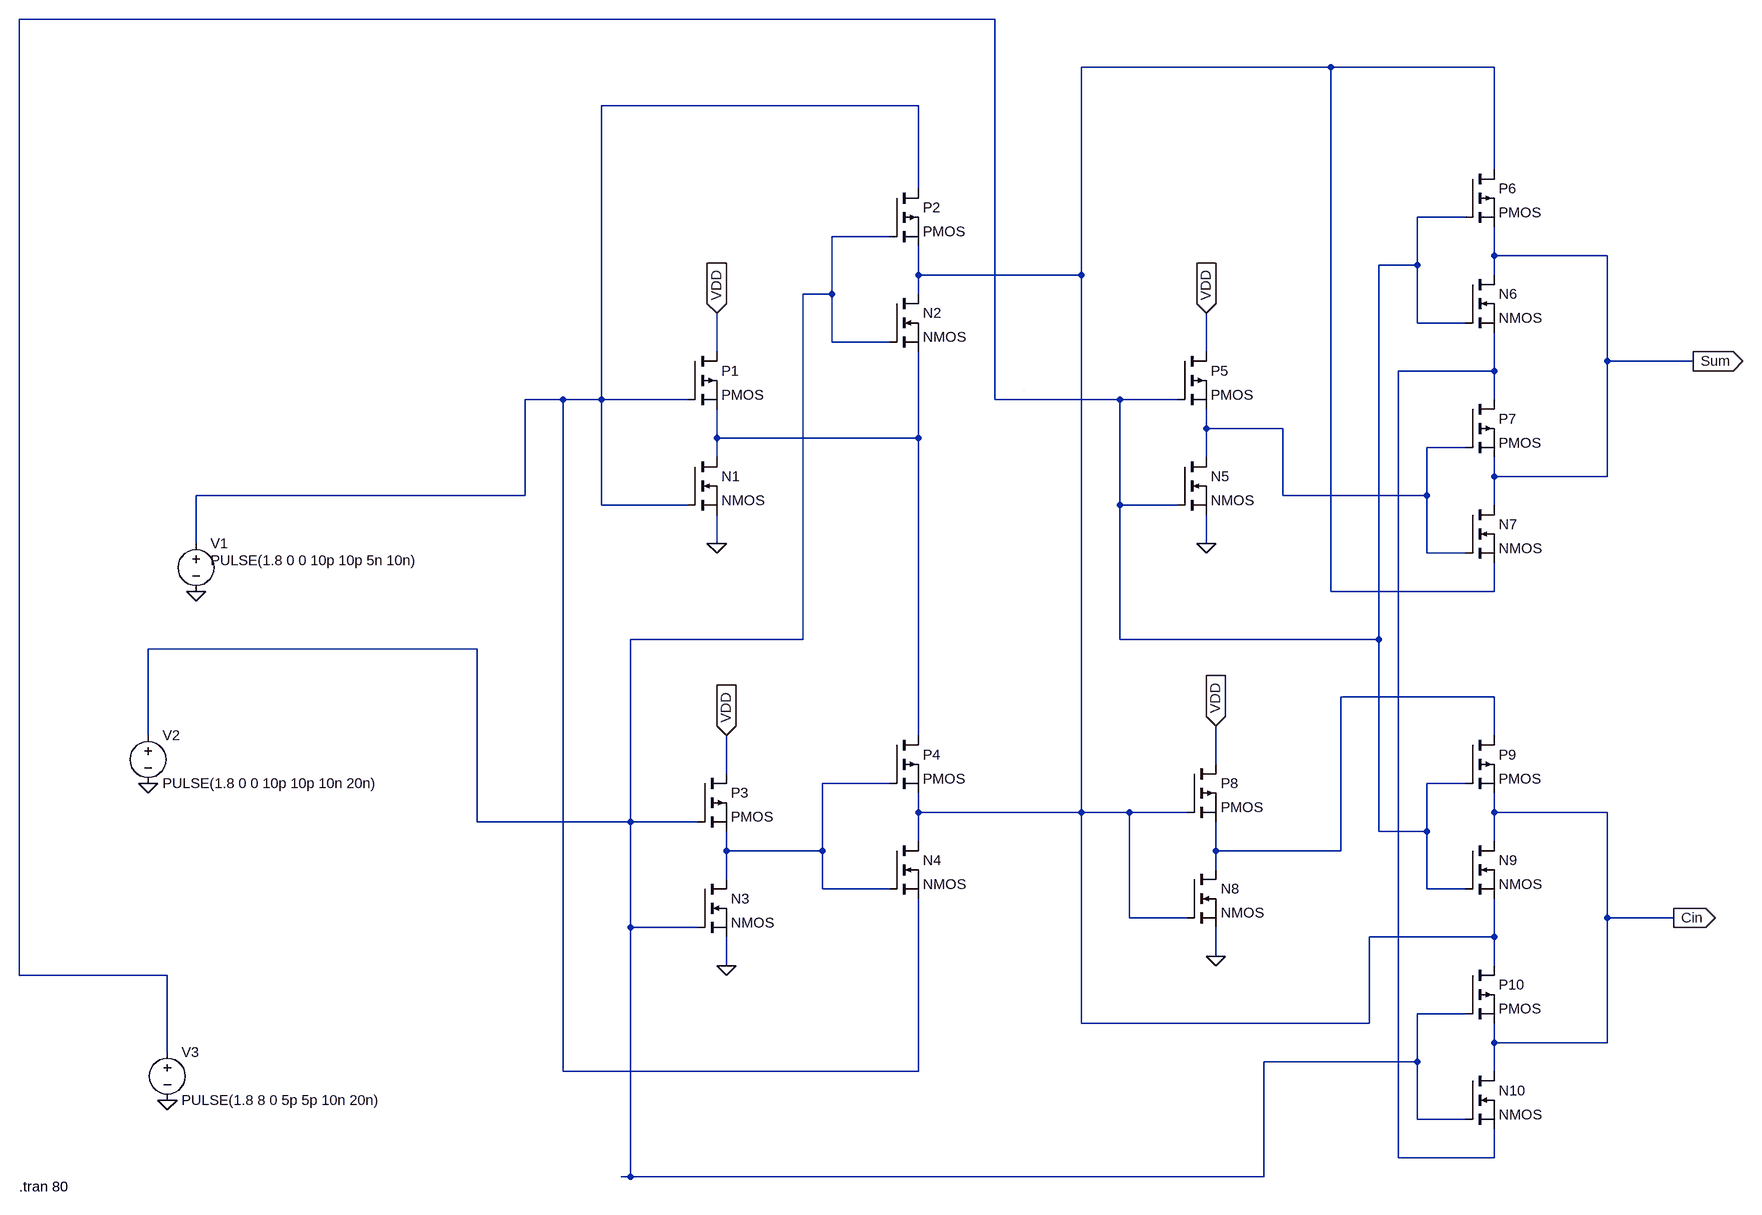
[diagram p0: schematic mp1 - Copy.asc]
mp1 - Copy.asc, the LTspice schematic file:
Version 4
SHEET 1 3316 1008
WIRE 1376 -976 -816 -976
WIRE 1936 -896 1520 -896
WIRE 2208 -896 1936 -896
WIRE 1248 -832 720 -832
WIRE 2208 -704 2208 -896
WIRE 1248 -672 1248 -832
WIRE 2160 -624 2080 -624
WIRE 1200 -592 1104 -592
WIRE 2208 -560 2208 -608
WIRE 2448 -560 2208 -560
WIRE 2080 -544 2080 -624
WIRE 2080 -544 2016 -544
WIRE 1248 -528 1248 -576
WIRE 1520 -528 1520 -896
WIRE 1520 -528 1248 -528
WIRE 2208 -528 2208 -560
WIRE 1104 -496 1104 -592
WIRE 1104 -496 1056 -496
WIRE 1248 -496 1248 -528
WIRE 2080 -448 2080 -544
WIRE 2160 -448 2080 -448
WIRE 1104 -416 1104 -496
WIRE 1200 -416 1104 -416
WIRE 912 -400 912 -464
WIRE 1728 -400 1728 -464
WIRE 2448 -384 2448 -560
WIRE 2688 -384 2448 -384
WIRE 2208 -368 2208 -432
WIRE 2208 -368 2048 -368
WIRE 656 -320 592 -320
WIRE 720 -320 720 -832
WIRE 720 -320 656 -320
WIRE 864 -320 720 -320
WIRE 1376 -320 1376 -976
WIRE 1584 -320 1376 -320
WIRE 1680 -320 1584 -320
WIRE 2208 -320 2208 -368
WIRE 1728 -272 1728 -304
WIRE 1856 -272 1728 -272
WIRE 912 -256 912 -304
WIRE 1248 -256 1248 -400
WIRE 1248 -256 912 -256
WIRE 2160 -240 2096 -240
WIRE 912 -224 912 -256
WIRE 1728 -224 1728 -272
WIRE 2208 -192 2208 -224
WIRE 2448 -192 2448 -384
WIRE 2448 -192 2208 -192
WIRE 592 -160 592 -320
WIRE 592 -160 -176 -160
WIRE 1856 -160 1856 -272
WIRE 2096 -160 2096 -240
WIRE 2096 -160 1856 -160
WIRE 720 -144 720 -320
WIRE 864 -144 720 -144
WIRE 1584 -144 1584 -320
WIRE 1680 -144 1584 -144
WIRE 2208 -144 2208 -192
WIRE -176 -80 -176 -160
WIRE 912 -80 912 -128
WIRE 1728 -80 1728 -128
WIRE 2096 -64 2096 -160
WIRE 2160 -64 2096 -64
WIRE 1936 0 1936 -896
WIRE 2208 0 2208 -48
WIRE 2208 0 1936 0
WIRE 1056 80 1056 -496
WIRE 1056 80 768 80
WIRE 1584 80 1584 -144
WIRE 2016 80 2016 -544
WIRE 2016 80 1584 80
WIRE 512 96 -256 96
WIRE 2208 176 1952 176
WIRE -256 240 -256 96
WIRE 1248 240 1248 -256
WIRE 2208 240 2208 176
WIRE 1744 288 1744 224
WIRE 928 304 928 240
WIRE 1200 320 1088 320
WIRE 2160 320 2096 320
WIRE 1248 368 1248 336
WIRE 1520 368 1520 -528
WIRE 1520 368 1248 368
WIRE 1600 368 1520 368
WIRE 1696 368 1600 368
WIRE 2208 368 2208 336
WIRE 2448 368 2208 368
WIRE 512 384 512 96
WIRE 768 384 768 80
WIRE 768 384 512 384
WIRE 880 384 768 384
WIRE 2016 400 2016 80
WIRE 2096 400 2096 320
WIRE 2096 400 2016 400
WIRE 1248 416 1248 368
WIRE 2208 416 2208 368
WIRE 928 432 928 400
WIRE 1088 432 1088 320
WIRE 1088 432 928 432
WIRE 1744 432 1744 384
WIRE 1952 432 1952 176
WIRE 1952 432 1744 432
WIRE 1744 464 1744 432
WIRE 928 480 928 432
WIRE 1088 496 1088 432
WIRE 1200 496 1088 496
WIRE 2096 496 2096 400
WIRE 2160 496 2096 496
WIRE 1600 544 1600 368
WIRE 1696 544 1600 544
WIRE 2448 544 2448 368
WIRE 2656 544 2448 544
WIRE 768 560 768 384
WIRE 880 560 768 560
WIRE 2208 576 2208 512
WIRE 2208 576 2000 576
WIRE 1744 608 1744 560
WIRE 928 624 928 576
WIRE 2208 624 2208 576
WIRE -816 640 -816 -976
WIRE -224 640 -816 640
WIRE 2160 704 2080 704
WIRE 1520 720 1520 368
WIRE 2000 720 2000 576
WIRE 2000 720 1520 720
WIRE 2208 752 2208 720
WIRE 2448 752 2448 544
WIRE 2448 752 2208 752
WIRE -224 768 -224 640
WIRE 2080 784 2080 704
WIRE 2080 784 1824 784
WIRE 656 800 656 -320
WIRE 1248 800 1248 512
WIRE 1248 800 656 800
WIRE 2208 800 2208 752
WIRE 2080 880 2080 784
WIRE 2160 880 2080 880
WIRE 2048 944 2048 -368
WIRE 2208 944 2208 896
WIRE 2208 944 2048 944
WIRE 768 976 768 560
WIRE 768 976 752 976
WIRE 1824 976 1824 784
WIRE 1824 976 768 976
FLAG 912 -80 0
FLAG 912 -464 VDD
IOPIN 912 -464 In
FLAG 928 624 0
FLAG 928 240 VDD
IOPIN 928 240 In
FLAG 1728 -80 0
FLAG 1728 -464 VDD
IOPIN 1728 -464 In
FLAG 1744 608 0
FLAG 1744 224 VDD
IOPIN 1744 224 In
FLAG 2656 544 Cin
IOPIN 2656 544 Out
FLAG 2688 -384 Sum
IOPIN 2688 -384 Out
FLAG -176 0 0
FLAG -256 320 0
FLAG -224 848 0
SYMBOL nmos 864 -224 R0
SYMATTR InstName N1
SYMBOL pmos 864 -400 R0
SYMATTR InstName P1
SYMBOL nmos 1200 -496 R0
SYMATTR InstName N2
SYMBOL pmos 1200 -672 R0
SYMATTR InstName P2
SYMBOL nmos 880 480 R0
SYMATTR InstName N3
SYMBOL pmos 880 304 R0
SYMATTR InstName P3
SYMBOL nmos 1200 416 R0
SYMATTR InstName N4
SYMBOL pmos 1200 240 R0
SYMATTR InstName P4
SYMBOL nmos 1680 -224 R0
SYMATTR InstName N5
SYMBOL pmos 1680 -400 R0
SYMATTR InstName P5
SYMBOL nmos 2160 -528 R0
SYMATTR InstName N6
SYMBOL pmos 2160 -704 R0
SYMATTR InstName P6
SYMBOL nmos 2160 -144 R0
SYMATTR InstName N7
SYMBOL pmos 2160 -320 R0
SYMATTR InstName P7
SYMBOL nmos 1696 464 R0
SYMATTR InstName N8
SYMBOL pmos 1696 288 R0
SYMATTR InstName P8
SYMBOL nmos 2160 416 R0
SYMATTR InstName N9
SYMBOL pmos 2160 240 R0
SYMATTR InstName P9
SYMBOL nmos 2160 800 R0
SYMATTR InstName N10
SYMBOL pmos 2160 624 R0
SYMATTR InstName P10
SYMBOL voltage -176 -96 R0
WINDOW 3 24 44 Left 2
WINDOW 123 0 0 Left 0
WINDOW 39 0 0 Left 0
SYMATTR Value PULSE(1.8 0 0 10p 10p 5n 10n)
SYMATTR InstName V1
SYMBOL voltage -256 224 R0
WINDOW 123 0 0 Left 0
WINDOW 39 0 0 Left 0
SYMATTR InstName V2
SYMATTR Value PULSE(1.8 0 0 10p 10p 10n 20n)
SYMBOL voltage -224 752 R0
WINDOW 123 0 0 Left 0
WINDOW 39 0 0 Left 0
SYMATTR InstName V3
SYMATTR Value PULSE(1.8 8 0 5p 5p 10n 20n)
TEXT -816 992 Left 2 !.tran 80
RECTANGLE Normal 1424 -336 1424 -336 2

The netlist it stands for:
* mp1 - Copy.asc
M§N1 N007 N003 0 0 NMOS
M§P1 VDD N003 N007 N007 PMOS
M§N2 N002 N004 N007 N007 NMOS
M§P2 N003 N004 N002 N002 PMOS
M§N3 N009 N004 0 0 NMOS
M§P3 VDD N004 N009 N009 PMOS
M§N4 N002 N009 N003 N003 NMOS
M§P4 N007 N009 N002 N002 PMOS
M§N5 N006 N001 0 0 NMOS
M§P5 VDD N001 N006 N006 PMOS
M§N6 Sum N001 N005 N005 NMOS
M§P6 N002 N001 Sum Sum PMOS
M§N7 Sum N006 N002 N002 NMOS
M§P7 N005 N006 Sum Sum PMOS
M§N8 N008 N002 0 0 NMOS
M§P8 VDD N002 N008 N008 PMOS
M§N9 Cin N001 N002 N002 NMOS
M§P9 N008 N001 Cin Cin PMOS
M§N10 Cin N004 N005 N005 NMOS
M§P10 N002 N004 Cin Cin PMOS
V1 N003 0 PULSE(1.8 0 0 10p 10p 5n 10n)
V2 N004 0 PULSE(1.8 0 0 10p 10p 10n 20n)
V3 N001 0 PULSE(1.8 8 0 5p 5p 10n 20n)
.model NMOS NMOS
.model PMOS PMOS
.lib standard.mos
.tran 80
.backanno
.end